# EAGLE design double sided pcb (EAGLE 9.5.2)
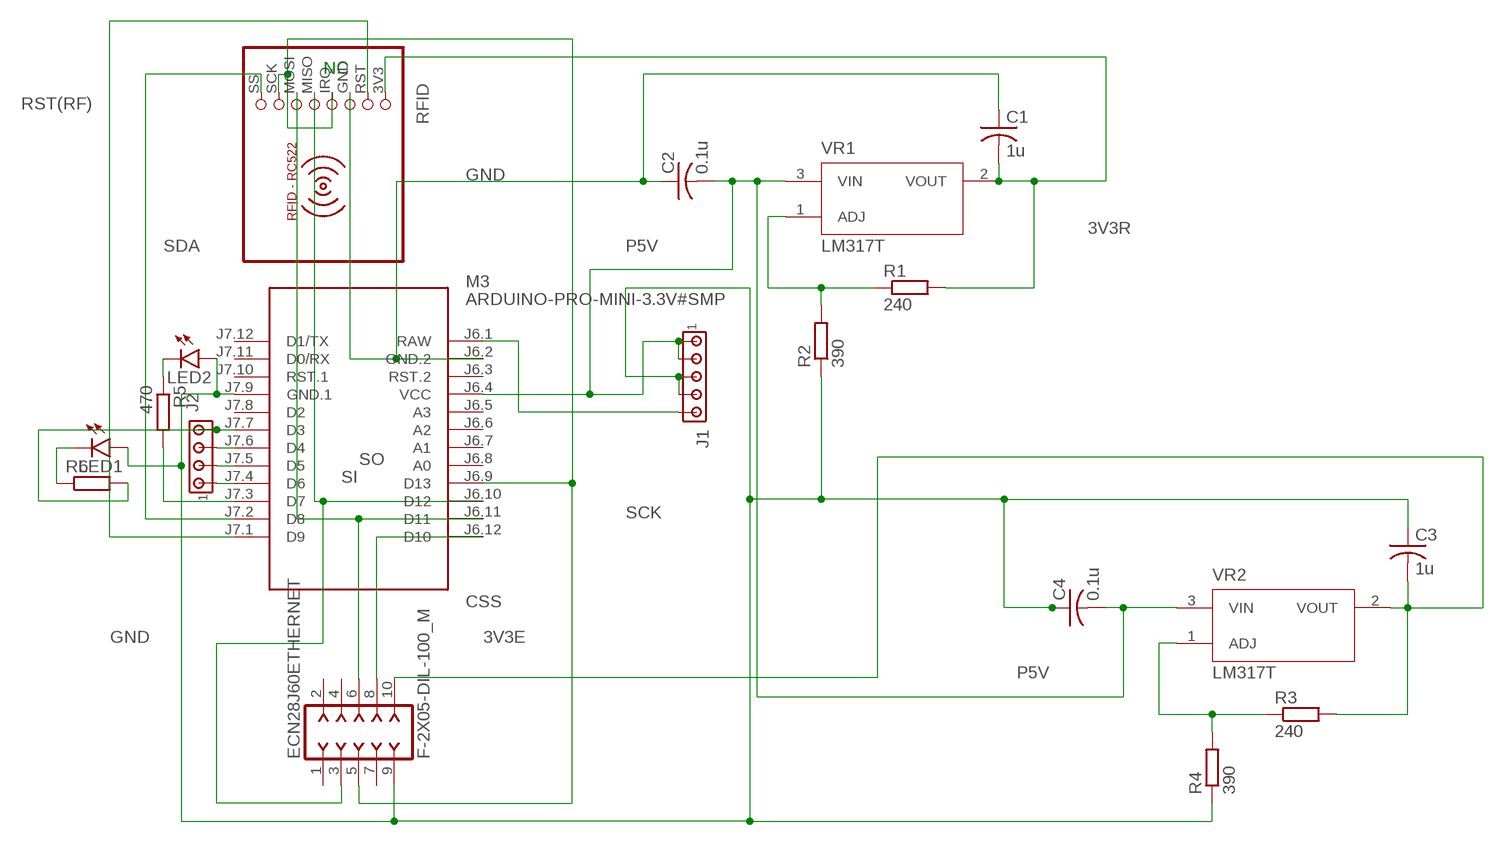
[diagram p0: schematic, sheet 1]

## Parts
C1  1u  C-US025-025X050  [C025-025X050]
C2  0.1u  C-US025-025X050  [C025-025X050]
C3  1u  C-US025-025X050  [C025-025X050]
C4  0.1u  C-US025-025X050  [C025-025X050]
ECN28J60ETHERNET  F-2X05-DIL-100_M  [DIL-100-2X05_M]
J1  MTA05-100  [10X05MTA]
J2  MTA04-100  [10X04MTA]
LED1  LED3MM  [LED3MM]
LED2  LED3MM  [LED3MM]
M3  ARDUINO-PRO-MINI-3.3V#SMP  [ARDUINO-PRO-MINI#SMP]
R1  240  R-EU_0207/10  [0207/10]
R2  390  R-EU_0207/10  [0207/10]
R3  240  R-EU_0207/10  [0207/10]
R4  390  R-EU_0207/10  [0207/10]
R5  470  R-EU_0207/10  [0207/10]
R6  R-EU_0207/10  [0207/10]
RFID  RFID-RC522  [RFID-RC522]
VR1  LM317T  [TO254P1054X470X1955-3]
VR2  LM317T  [TO254P1054X470X1955-3]

## Nets
3V3E: C3.2 ECN28J60ETHERNET.10 R3.2 VR2.2(VOUT)
3V3R: C1.2 R1.2 RFID.3V3 VR1.2(VOUT)
9V: J1.5 M3.J6.1(RAW)
CSS: ECN28J60ETHERNET.8 M3.J6.12(D10)
GND: C1.1 C2.1 C3.1 C4.1 ECN28J60ETHERNET.9 J1.3 J1.4 LED1.A LED2.A M3.J6.2(GND.2) M3.J7.9(GND.1) R2.1 R4.1 RFID.GND
N$1: R1.1 R2.2 VR1.1(ADJ)
N$2: R3.1 R4.2 VR2.1(ADJ)
N$3: J2.3 M3.J7.6(D4)
N$4: LED2.K(C) R5.1
N$5: M3.J7.3(D7) R5.2
N$6: J2.1 M3.J7.4(D6)
N$7: J2.2 M3.J7.5(D5)
N$8: J2.4 M3.J7.7(D3) R6.2
N$10: LED1.K(C) R6.1
P5V: C2.2 C4.2 J1.1 J1.2 M3.J6.4(VCC) VR1.3(VIN) VR2.3(VIN)
RST(RF): M3.J7.1(D9) RFID.RST
SCK: ECN28J60ETHERNET.5 M3.J6.9(D13) RFID.IRQ RFID.SCK
SDA: M3.J7.2(D8) RFID.SS
SI: ECN28J60ETHERNET.6 M3.J6.11(D11) RFID.MOSI
SO: ECN28J60ETHERNET.3 M3.J6.10(D12) RFID.MISO
Unconnected: ECN28J60ETHERNET.1 ECN28J60ETHERNET.2 ECN28J60ETHERNET.4 ECN28J60ETHERNET.7 M3.J6.3(RST.2) M3.J6.5(A3) M3.J6.6(A2) M3.J6.7(A1) M3.J6.8(A0) M3.J7.8(D2) M3.J7.10(RST.1) M3.J7.11(D0/RX) M3.J7.12(D1/TX)

## Notes on the sheet
- NC

## Library data of the parts
C1-C4 = rcl:C-US: CAPACITOR, American symbol; SPICEPREFIX: C
ECN28J60ETHERNET = con-headers-jp:F-2X05-: FEMALE HEADER
J1 = con-amp:MTA05-100: AMP connector
J2 = con-amp:MTA04-100: AMP connector
LED1 LED2 = led:LED: LED OSRAM: - CHIPLED LG R971, LG N971, LY N971, LG Q971, LY Q971, LO R971, LY R971 LH N974, LH R974 LS Q976, LO Q976, LY Q976 LO Q996 - Hyper CHIPLED LW Q18S LB Q993, LB Q99A, LB R99A - SideLED LS A670, LO A670, LY A670, LG A670, LP A670 LB A673, LV A673, LT A673, LW A673 LH A674 LY A675 LS A676, LA A676, LO A676, LY A676, LW A676 LS A679, LY A679, LG A679 - Hyper Micro SIDELED® LS Y876, LA Y876, LO Y876, LY Y876 LT Y87S - SmartLED LW L88C, LW L88S LB L89C, LB L89S, LG L890 LS L89K, LO L89K, LY L89K LS L896, LA L896, LO L896, LY L896 - TOPLED LS T670, LO T670, LY T670, LG T670, LP T670 LSG T670, LSP T670, LSY T670, LOP T670, LYG T670 LG T671, LOG T671, LSG T671 LB T673, LV T673, LT T673, LW T673 LH T674 LS T676, LA T676, LO T676, LY T676, LB T676, LH T676, LSB T676, LW T676 LB T67C, LV T67C, LT T67C, LS T67K, LO T67K, LY T67K, LW E67C LS E67B, LA E67B, LO E67B, LY E67B, LB E67C, LV E67C, LT E67C LW T67C LS T679, LY T679, LG T679 LS T770, LO T770, LY T770, LG T770, LP T770 LB T773, LV T773, LT T773, LW T773 LH T774 LS E675, LA E675, LY E675, LS T675 LS T776, LA T776, LO T776, LY T776, LB T776 LHGB T686 LT T68C, LB T68C - Hyper Mini TOPLED® LB M676 - Mini TOPLED Santana® LG M470 LS M47K, LO M47K, LY M47K Source: http://www.osram.convergy.de LUXEON: - LUMILED® LXK2-PW12-R00, LXK2-PW12-S00, LXK2-PW14-U00, LXK2-PW14-V00 LXK2-PM12-R00, LXK2-PM12-S00, LXK2-PM14-U00 LXK2-PE12-Q00, LXK2-PE12-R00, LXK2-PE12-S00, LXK2-PE14-T00, LXK2-PE14-U00 LXK2-PB12-K00, LXK2-PB12-L00, LXK2-PB12-M00, LXK2-PB14-N00, LXK2-PB14-P00, LXK2-PB14-Q00 LXK2-PR12-L00, LXK2-PR12-M00, LXK2-PR14-Q00, LXK2-PR14-R00 LXK2-PD12-Q00, LXK2-PD12-R00, LXK2-PD12-S00 LXK2-PH12-R00, LXK2-PH12-S00 LXK2-PL12-P00, LXK2-PL12-Q00, LXK2-PL12-R00 Source: www.luxeon.com KINGBRIGHT: KA-3528ASYC Source: www.kingbright.com
M3 = diy-modules:ARDUINO-PRO-MINI-*#SMP: Arduino Pro Mini (and compatible devices) with 2 connectors only More details available here: https://www.arduino.cc/en/Main/ArduinoBoardProMini Click here to find device on ebay.com <http://www.ebay.com/sch/arduino+pro+mini>
R1-R6 = rcl:R-EU_: RESISTOR, European symbol; SPICEPREFIX: R
RFID = mfrc522-module:RFID-RC522: RFID-RC522 MFRC-522 based breakout board
VR1 VR2 = LM317T:LM317T: Standard Regulator Pos 1.2V to 37V 0.4A 3-Pin(3+Tab) TO-220 Rail; AVAILABILITY: Unavailable; DESCRIPTION: Standard Regulator Pos 1.2V to 37V 0.4A 3-Pin_3+Tab_ TO-220 Rail; MF: Texas Instruments; MP: LM317T; PACKAGE: TO-220-3 HTC Korea; PRICE: None

## Board
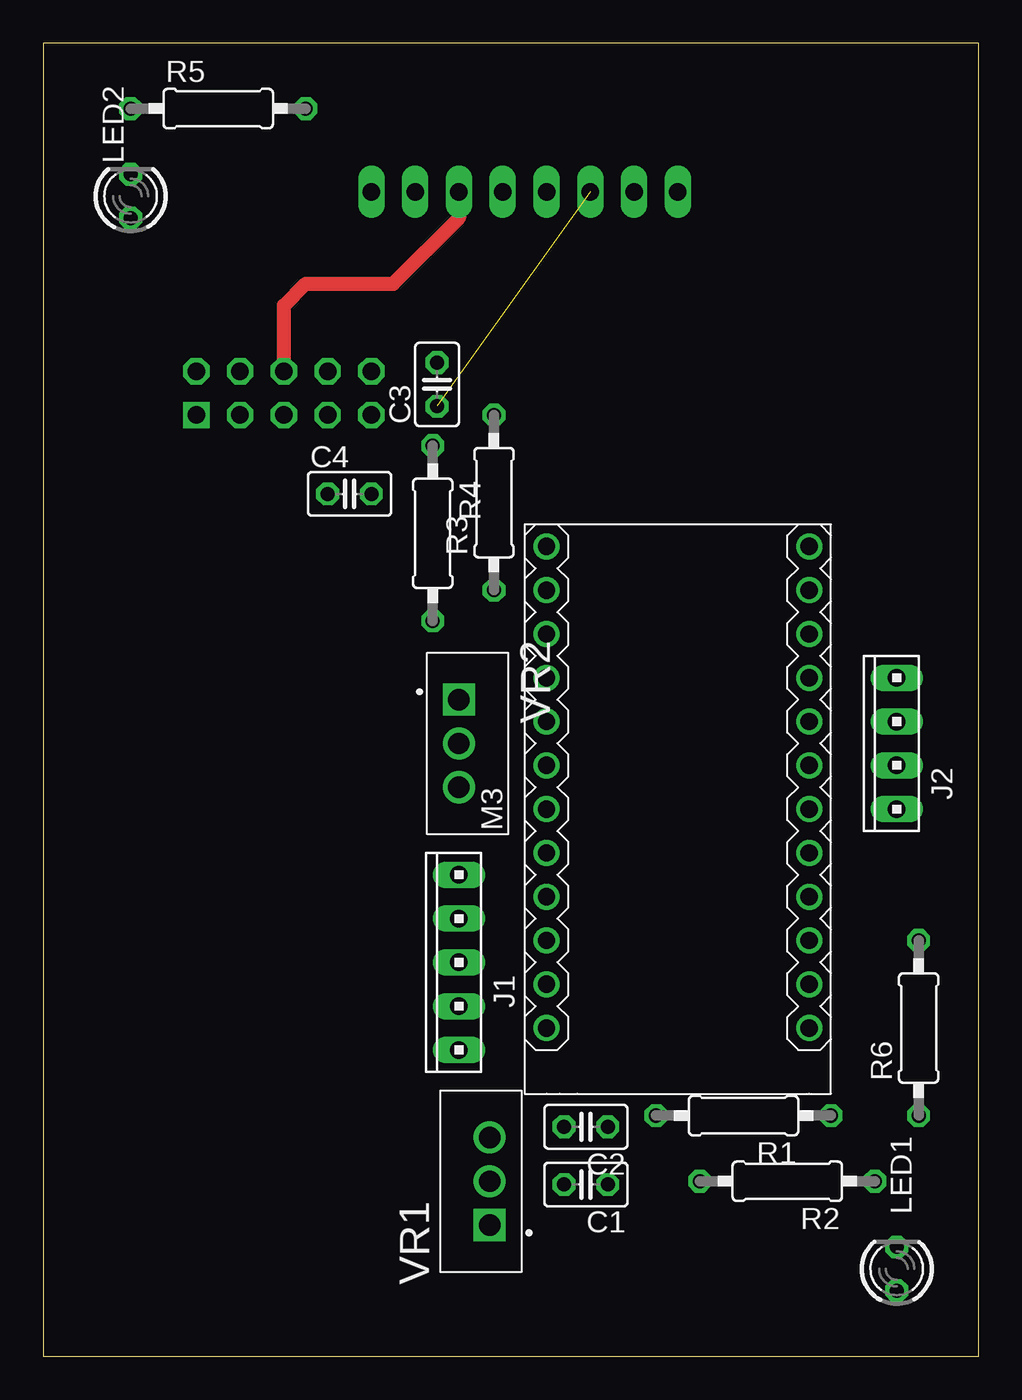
[diagram p1: board, top side]
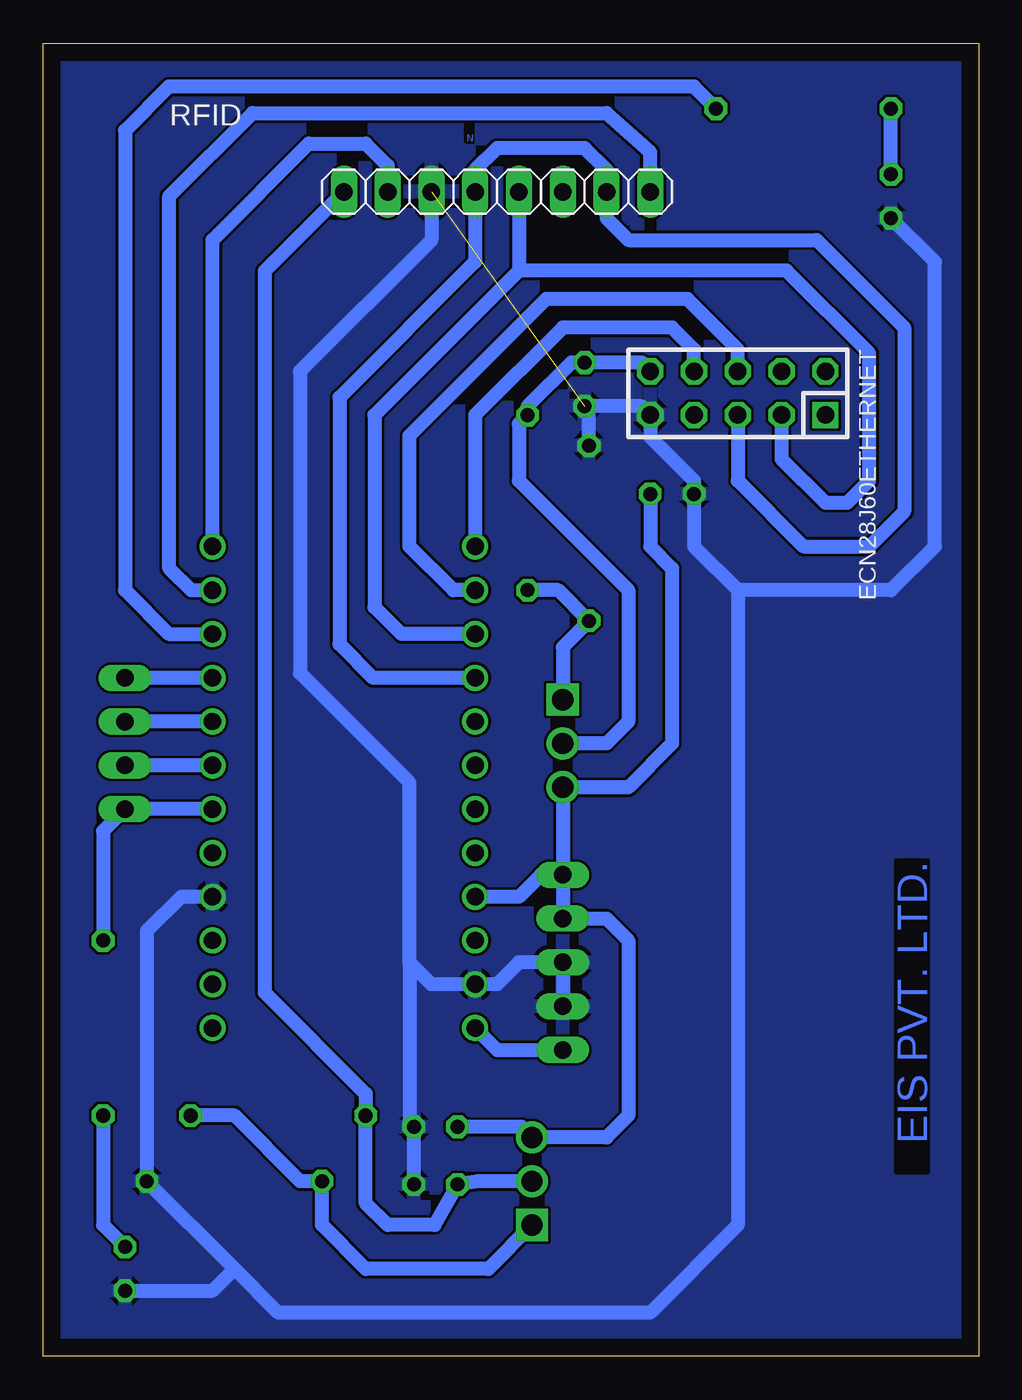
[diagram p2: board, bottom side, seen from below]

Size 54.28 x 76.19 mm. Coordinates in mm from the lower left corner, seen from the top.
Outline: 0,0 54.28,0 54.28,76.19 0,76.19 0,0
Copper layers (1*16): Top 0.035mm / dielectric 1.5mm / Bottom 0.035mm
Design rules "default": minimum track width 6mil, minimum drill 0.35mm, track to track 6mil, track to pad 6mil, pad to pad 6mil, via to via 6mil, smd to smd 6mil, copper to edge 40mil, drill to drill 6mil, minimum pad ring 10mil, minimum via ring 8mil, stop-mask expansion 4mil, vias tented up to drill 0mil, thermal gap 10mil

### Footprints (pad centres in the part's own frame; a part is rotated, then mirrored left to right if it is on the bottom)
C025-025X050 = drill 0.813 octagon: 1 -1.27,0; 2 1.27,0
DIL-100-2X05_M = drill 1.016 square: 1 -5.08,1.27 | drill 1.016 octagon: 2 -5.08,-1.27; 3 -2.54,1.27; 4 -2.54,-1.27; 5 0,1.27; 6 0,-1.27; 7 2.54,1.27; 8 2.54,-1.27; 9 5.08,1.27; 10 5.08,-1.27
10X05MTA = drill 1.016 long: 1 5.08,0; 2 2.54,0; 3 0,0; 4 -2.54,0; 5 -5.08,0
10X04MTA = drill 1.016 long: 1 3.81,0; 2 1.27,0; 3 -1.27,0; 4 -3.81,0
LED3MM = drill 0.813 octagon: A -1.27,0; K 1.27,0
ARDUINO-PRO-MINI#SMP = drill 1: J6.1 -12.7,7.62; J6.2 -10.16,7.62; J6.3 -7.62,7.62; J6.4 -5.08,7.62; J6.5 -2.54,7.62; J6.6 0,7.62; J6.7 2.54,7.62; J6.8 5.08,7.62; J6.9 7.62,7.62; J6.10 10.16,7.62; J6.11 12.7,7.62; J6.12 15.24,7.62; J7.1 15.24,-7.62; J7.2 12.7,-7.62; J7.3 10.16,-7.62; J7.4 7.62,-7.62; J7.5 5.08,-7.62; J7.6 2.54,-7.62; J7.7 0,-7.62; J7.8 -2.54,-7.62; J7.9 -5.08,-7.62; J7.10 -7.62,-7.62; J7.11 -10.16,-7.62; J7.12 -12.7,-7.62
0207/10 = drill 0.813 octagon: 1 -5.08,0; 2 5.08,0
RFID-RC522 = drill 1.016 long: 3V3 -8.89,0; GND -3.81,0; IRQ -1.27,0; MISO 1.27,0; MOSI 3.81,0; RST -6.35,0; SCK 6.35,0; SS 8.89,0
TO254P1054X470X1955-3 = drill 1.24 pad 1.86 square: 1 -2.54,-0.51 | drill 1.24 pad 1.86: 2 0,-0.51; 3 2.54,-0.51

### Placement (x,y rotation side)
C1  31.5,9.97 180 top
C2  31.5,13.32 180 top
C3  22.86,56.39 90 top
C4  17.78,50.04 0 top
ECN28J60ETHERNET  13.97,55.88 180 bottom
J1  24.13,22.86 90 top
J2  49.53,35.56 90 top
LED1  49.53,5.08 90 top
LED2  5.08,67.31 90 top
M3  36.83,31.75 90 top
R1  40.64,13.97 180 top
R2  43.18,10.16 180 top
R3  26.16,49.53 90 top
R4  22.61,47.75 270 top
R5  10.16,72.39 0 top
R6  50.8,19.05 90 top
RFID  27.94,67.56 0 bottom
VR1  25.4,10.16 90 top
VR2  24.64,35.56 270 top

### Tracks (layer width: path | path; a pad name or v marks a point on that pad's centre or on a via)
3V3E
  Bottom 0.813: ECN28J60ETHERNET.10 19.56,57.66 C3.2 23.62,57.66 26.16,55.12 R3.2 26.67,54.1 26.67,50.8 20.32,44.45 20.32,36.83 21.59,35.56 VR2.2
3V3R
  Bottom 0.813: RFID.3V3 41.42,62.97 41.42,21.11 35.56,15.24 R1.2 35.56,8.89 34.29,7.62 31.56,7.62 C1.2 29.02,10.16 VR1.2
9V
  Bottom 0.813: M3.J6.1 27.94,17.78 J1.5
CSS
  Bottom 0.813: ECN28J60ETHERNET.8 16.51,58.42 17.78,59.69 24.13,59.69 29.21,54.61 M3.J6.12
GND  (1 unrouted)
  Bottom 0.813: 33.02,22.86 31.75,21.59 M3.J6.2 27.94,21.59 26.67,22.86 J1.3 J1.4 | 33.02,22.86 33.02,33.29 39.37,39.64 39.37,57.15 31.75,64.77 RFID.GND | LED2.A 2.54,63.5 2.54,46.99 5.08,44.45 13.97,44.45 | M3.J7.9 46.26,26.67 48.26,24.67 R2.1 43.18,5.08 | 13.97,44.45 16.51,46.99 C4.1 16.51,50.8 19.05,53.34 ECN28J60ETHERNET.9 19.56,55.12 C3.1 22.61,54.86 R4.1 | 43.18,5.08 40.64,2.54 19.05,2.54 13.97,7.62 13.97,44.45 | 33.02,22.86 33.02,13.57 C2.1 C1.1 | LED1.A 44.45,3.81 43.18,5.08
  pour Bottom: 0,76.2 54.61,76.2 54.61,0 0,0
N$1
  Bottom 0.813: VR1.1 28.45,5.08 35.56,5.08 38.1,7.62 R2.2 39.37,10.16 43.18,13.97 R1.1
N$2
  Bottom 0.813: R3.1 24.38,44.45 R4.2 24.13,41.15 VR2.1
N$3
  Bottom 0.813: M3.J7.6 J2.3
N$4
  Bottom 0.813: LED2.K R5.1
N$5
  Bottom 0.813: R5.2 16.51,73.66 46.99,73.66 49.53,71.12 49.53,44.45 46.99,41.91 M3.J7.3
N$6
  Bottom 0.813: M3.J7.4 J2.1
N$7
  Bottom 0.813: M3.J7.5 J2.2
N$8
  Bottom 0.813: M3.J7.7 J2.4 50.8,30.48 R6.2
N$10
  Bottom 0.813: R6.1 50.8,7.62 LED1.K
P5V
  Bottom 0.813: M3.J6.4 26.67,26.67 25.4,27.94 J1.1 | C4.2 19.05,46.99 17.78,45.72 17.78,35.56 20.32,33.02 VR2.3 J1.1 | J1.1 J1.2 21.59,25.4 20.32,24.13 20.32,13.97 21.59,12.7 VR1.3 26.53,13.32 C2.2
RST(RF)
  Bottom 0.813: M3.J7.1 44.45,64.77 38.86,70.36 35.56,70.36 34.29,69.09 RFID.RST
SCK
  Bottom 0.813: M3.J6.9 35.13,39.37 37.08,41.33 37.08,55.63 29.21,63.5 RFID.IRQ 29.21,68.83 27.94,70.1 22.86,70.1 21.59,68.83 RFID.SCK 21.59,66.04 20.32,64.77 9.4,64.77 4.32,59.69 4.32,49.02 6.35,46.99 10.16,46.99 13.97,50.8 ECN28J60ETHERNET.5
SDA
  Bottom 0.813: RFID.SS 19.05,69.85 21.59,72.14 42.13,72.14 46.96,67.31 46.96,45.72 45.69,44.45 M3.J7.2
SI
  Top 0.813: RFID.MOSI 24.13,66.04 20.32,62.23 15.24,62.23 13.97,60.96 ECN28J60ETHERNET.6
  Bottom 0.813: M3.J6.11 30.48,44.45 33.02,46.99 33.02,53.42 25.1,61.34 16.89,61.34 13.97,58.42 ECN28J60ETHERNET.6
SO
  Bottom 0.813: RFID.MISO 26.67,62.99 | M3.J6.10 33.49,41.91 35.05,43.47 35.05,54.61 26.67,62.99 | 26.67,62.99 11.15,62.99 6.35,58.19 6.35,50.8 7.62,49.53 8.89,49.53 11.43,52.07 ECN28J60ETHERNET.3

### Text on the board
Bottom: N | EIS PVT. LTD.